# EasyEDA schematic Deney1Devresi20HZ.json
TITLE: opamp_example; REV: 1.0; Date: 2025-12-08; Sheet: 1/1; Drawn By: seckin.ac; Company: ADU-COMP_ENG
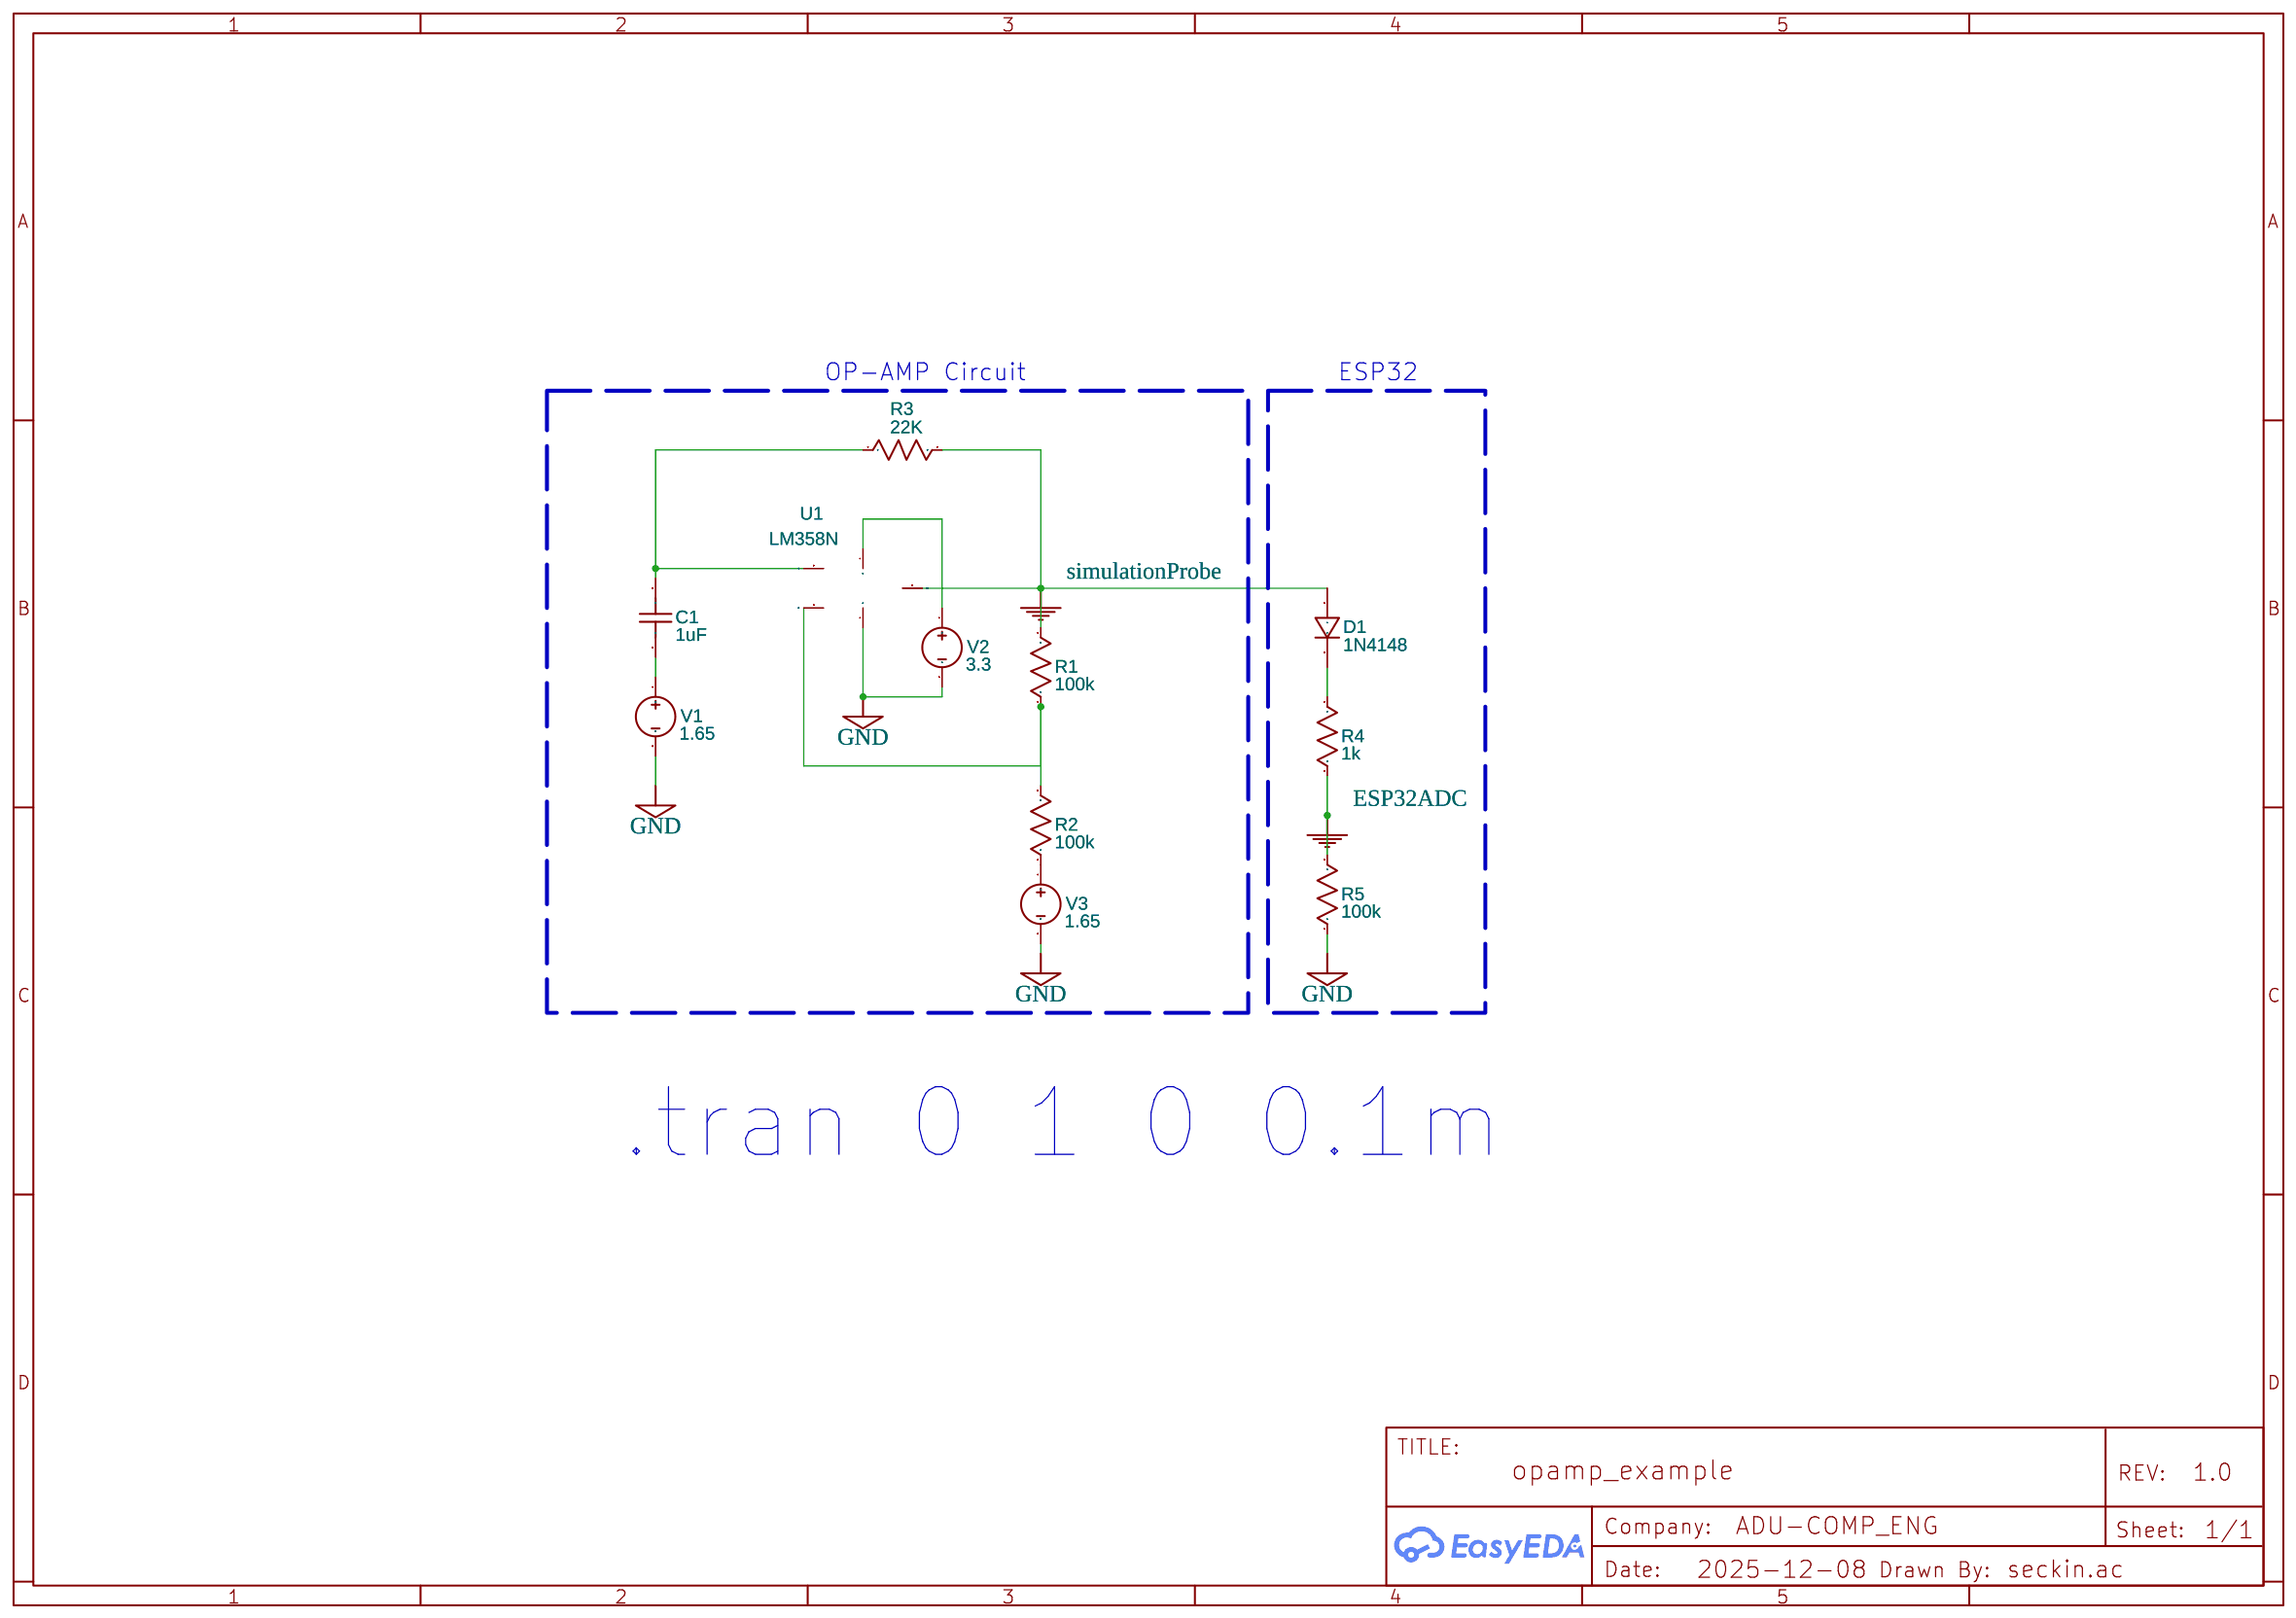
[diagram p0: schematic sheet]

## Parts
C1  1uF  [RAD-0.1]
D1  1N4148  [DO-35]
R1  100k  [AXIAL-0.3]
R2  100k  [AXIAL-0.3]
R3  22K  [AXIAL-0.3]
R4  1k  [AXIAL-0.3]
R5  100k  [AXIAL-0.3]
U1  LM358N  [?]
V1  1.65  [HDR1X2]
V2  3.3  [HDR1X2]
V3  1.65  [HDR1X2]

## Library data of the parts
C1 = Capacitor_US: Contributor: EasyEDA; Supplier: YUJING; Capacitance: 1u
D1 = 1N4148: Contributor: EasyEDA
R1-R3 R5 = Resistor_US: Resistance: 1k; Contributor: EasyEDA; Supplier: YUJING
R4 = Resistor_US: Contributor: EasyEDA; Supplier: YUJING
U1 = LM358N: Contributor: EasyEDA
V1-V3 = VDC: Contributor: EasyEDA; sim: true

## Nets
GND: R5.1 U1.4(V-) V1.2 V2.2 V3.2
ESP32ADC: R4.2 R5.2
simulationProbe: D1.1(A) R1.2 R3.2 U1.6(OUT)
Net-(C1-1): C1.1 V1.1
Net-(C1-2): C1.2 R3.1 U1.2(IN-)
Net-(D1-2): D1.2(K) R4.1
Net-(R1-1): R1.1 R2.2 U1.3(IN+)
Net-(R2-1): R2.1 V3.1
Net-(U1-7): U1.7(V+) V2.1

## Notes on the sheet
- OP-AMP Circuit
- ESP32
- .tran 0 1 0 0.1m
